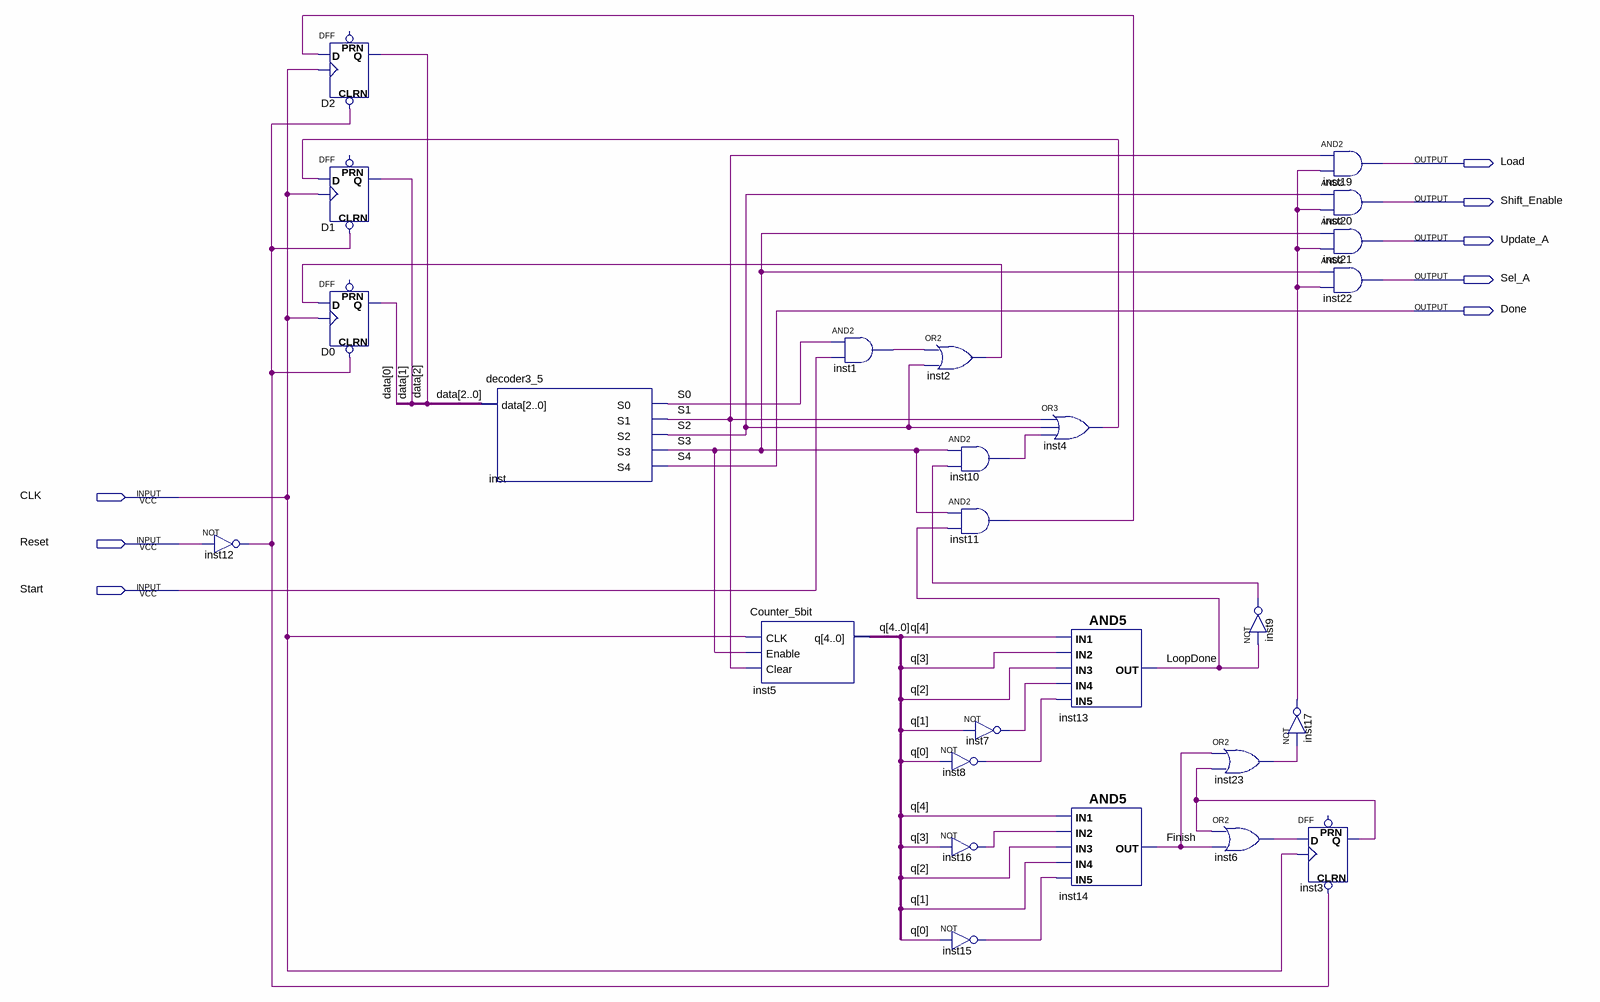
[diagram p0: schematic sheet]
// Quartus schematic Controller_Div.bdf as structural Verilog: 26 symbols, 8 pins
module Controller_Div (
  input  CLK,
  input  Reset,
  input  Start,
  output Load,
  output Shift_Enable,
  output Update_A,
  output Sel_A,
  output Done
);

  wire Finish, inst1_out, inst2_out, inst3_q, inst4_out, inst6_out, inst7_out, inst8_out, inst9_out,
       inst10_out, inst11_out, inst12_out, inst15_out, inst16_out, inst17_out, inst23_out, LoopDone, S0, S1,
       S2, S3;
  wire [2:0] data;
  wire [4:0] q;

  not inst12 (inst12_out, Reset);
  DFF D2 (.CLRN(inst12_out), .CLK(CLK), .D(inst11_out), .Q(data[2]));  // open: PRN
  DFF D1 (.CLRN(inst12_out), .CLK(CLK), .D(inst4_out), .Q(data[1]));  // open: PRN
  DFF D0 (.CLRN(inst12_out), .CLK(CLK), .D(inst2_out), .Q(data[0]));  // open: PRN
  decoder3_5 inst (.data(data), .S0(S0), .S1(S1), .S2(S2), .S3(S3), .S4(Done));
  Counter_5bit inst5 (.CLK(CLK), .Enable(S3), .Clear(S1), .q(q));
  and inst1 (inst1_out, S0, Start);
  or inst2 (inst2_out, inst1_out, S2);
  and inst10 (inst10_out, S3, inst9_out);
  and inst11 (inst11_out, S3, LoopDone);
  not inst8 (inst8_out, q[0]);
  not inst16 (inst16_out, q[3]);
  not inst15 (inst15_out, q[0]);
  not inst7 (inst7_out, q[1]);
  or inst4 (inst4_out, S1, S2, inst10_out);
  and inst13 (LoopDone, q[4], q[3], q[2], inst7_out, inst8_out);
  and inst14 (Finish, q[4], inst16_out, q[2], q[1], inst15_out);
  not inst9 (inst9_out, LoopDone);
  or inst23 (inst23_out, Finish, inst3_q);
  or inst6 (inst6_out, inst3_q, Finish);
  and inst19 (Load, S1, inst17_out);
  and inst20 (Shift_Enable, S2, inst17_out);
  and inst21 (Update_A, S3, inst17_out);
  and inst22 (Sel_A, S3, inst17_out);
  not inst17 (inst17_out, inst23_out);
  DFF inst3 (.CLRN(inst12_out), .CLK(CLK), .D(inst6_out), .Q(inst3_q));  // open: PRN

  // Other names for the same wires on the sheet: S4 = Done
endmodule
